# EAGLE schematic pcm2707_v1 (EAGLE 6.4)

## Sheet 1 of 3: Power - 3.3D
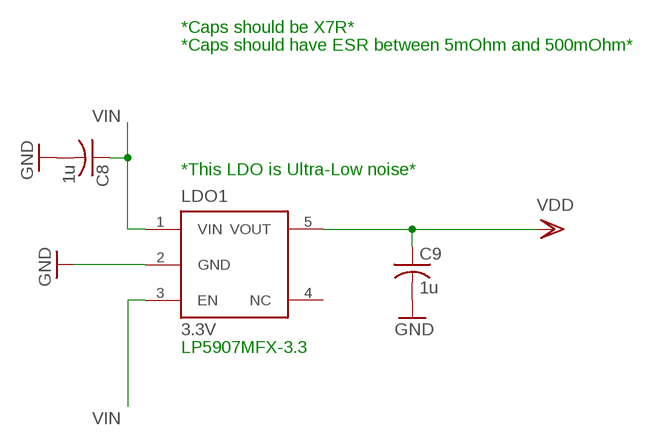
[diagram p0: schematic, sheet 1]

### Parts
C8  1u  C-USC0805  [C0805]
C9  1u  C-USC0805  [C0805]
LDO1  3.3V  LP5907MXF-3.3  [SOT-23]

### Nets
GND: C8.2 C9.2 LDO1.2(GND) ; also sheet 2,3
VDD: C9.1 LDO1.5(VOUT) ; also sheet 2
VIN: C8.1 LDO1.1(VIN) LDO1.3(EN)
Unconnected: LDO1.4(NC)

### Notes on the sheet
- *Caps should be X7R*
- *Caps should have ESR between 5mOhm and 500mOhm*
- *This LDO is Ultra-Low noise*
- LP5907MFX-3.3

## Sheet 2 of 3: DAC
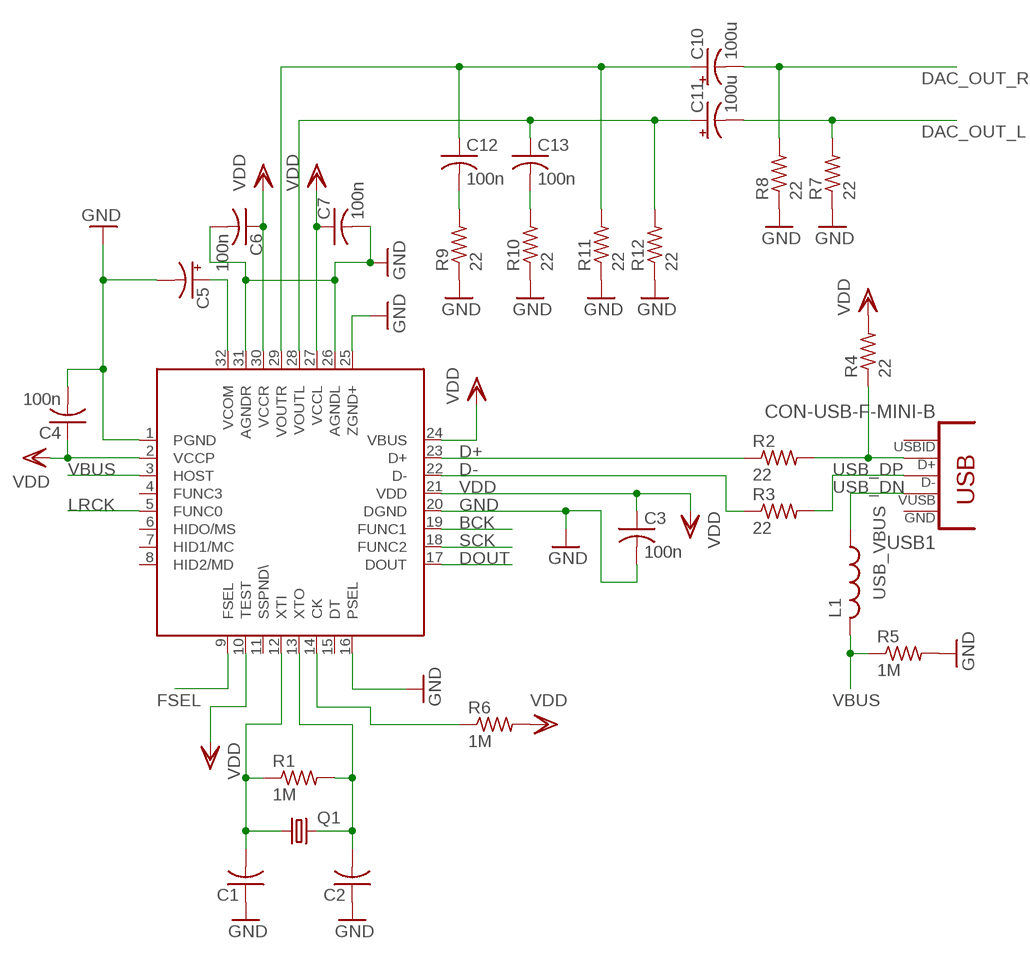
[diagram p1: schematic, sheet 2]

### Parts
C1  C-USC0402  [C0402]
C2  C-USC0402  [C0402]
C3  100n  C-USC0402  [C0402]
C4  100n  C-USC0402  [C0402]
C5  CPOL-USE1.8-4  [E1,8-4]
C6  100n  C-USC0402  [C0402]
C7  100n  C-USC0402  [C0402]
C10  100u  CPOL-USE1.8-4  [E1,8-4]
C11  100u  CPOL-USE1.8-4  [E1,8-4]
C12  100n  C-USC0402  [C0402]
C13  100n  C-USC0402  [C0402]
L1  L-USL3225M  [L3225M]
Q1  CRYSTALHC49US  [HC49US]
R1  1M  R-US_R0603  [R0603]
R2  22  R-US_R0402  [R0402]
R3  22  R-US_R0402  [R0402]
R4  22  R-US_R0402  [R0402]
R5  1M  R-US_R0402  [R0402]
R6  1M  R-US_R0402  [R0402]
R7  22  R-US_R0402  [R0402]
R8  22  R-US_R0402  [R0402]
R9  22  R-US_R0402  [R0402]
R10  22  R-US_R0402  [R0402]
R11  22  R-US_R0402  [R0402]
R12  22  R-US_R0402  [R0402]
U$1  PCM2707  [PCM2707]
USB1  CON-USB-F-MINI-B  [CONN_USB_MINI-B]

### Nets
BCK: U$1.19(FUNC1)
D+: R2.1 U$1.23(D+)
D-: R3.1 U$1.22(D-)
DAC_OUT_L: C11.- R7.2 ; also sheet 3
DAC_OUT_R: C10.- R8.2 ; also sheet 3
DOUT: U$1.17(DOUT)
FSEL: U$1.9(FSEL)
GND: C1.1 C2.1 C3.2 C4.2 C5.- C6.2 C7.2 R5.2 R7.1 R8.1 R9.1 R10.1 R11.1 R12.1 U$1.1(PGND) U$1.16(PSEL) U$1.20(DGND) U$1.25(ZGND+) U$1.26(AGNDL) U$1.31(AGNDR) ; also sheet 1,3
LRCK: U$1.5(FUNC0)
N$1: C5.+ U$1.32(VCOM)
N$2: C10.+ C12.1 R11.2 U$1.29(VOUTR)
N$3: C11.+ C13.1 R12.2 U$1.28(VOUTL)
N$6: C12.2 R9.2
N$7: C13.2 R10.2
N$10: R6.1 U$1.14(CK)
SCK: U$1.18(FUNC2)
USB_DN: R3.2 USB1.D-
USB_DP: R2.2 R4.1 USB1.D+
USB_VBUS: L1.1 USB1.VUSB
VBUS: L1.2 R5.1 U$1.3(HOST)
VDD: C3.1 C4.1 C6.1 C7.1 R4.2 R6.2 U$1.2(VCCP) U$1.10(TEST) U$1.21(VDD) U$1.24(VBUS) U$1.27(VCCL) U$1.30(VCCR) ; also sheet 1
XTI: C1.2 Q1.1 R1.1 U$1.12(XTI)
XTO: C2.2 Q1.2 R1.2 U$1.13(XTO)
Unconnected: U$1.4(FUNC3) U$1.6(HIDO/MS) U$1.7(HID1/MC) U$1.8(HID2/MD) U$1.11(SSPND\) U$1.15(DT) USB1.BODY@1(BODY) USB1.BODY@2(BODY) USB1.BODY@3(BODY) USB1.BODY@4(BODY) USB1.GND USB1.ID(USBID)

## Sheet 3 of 3
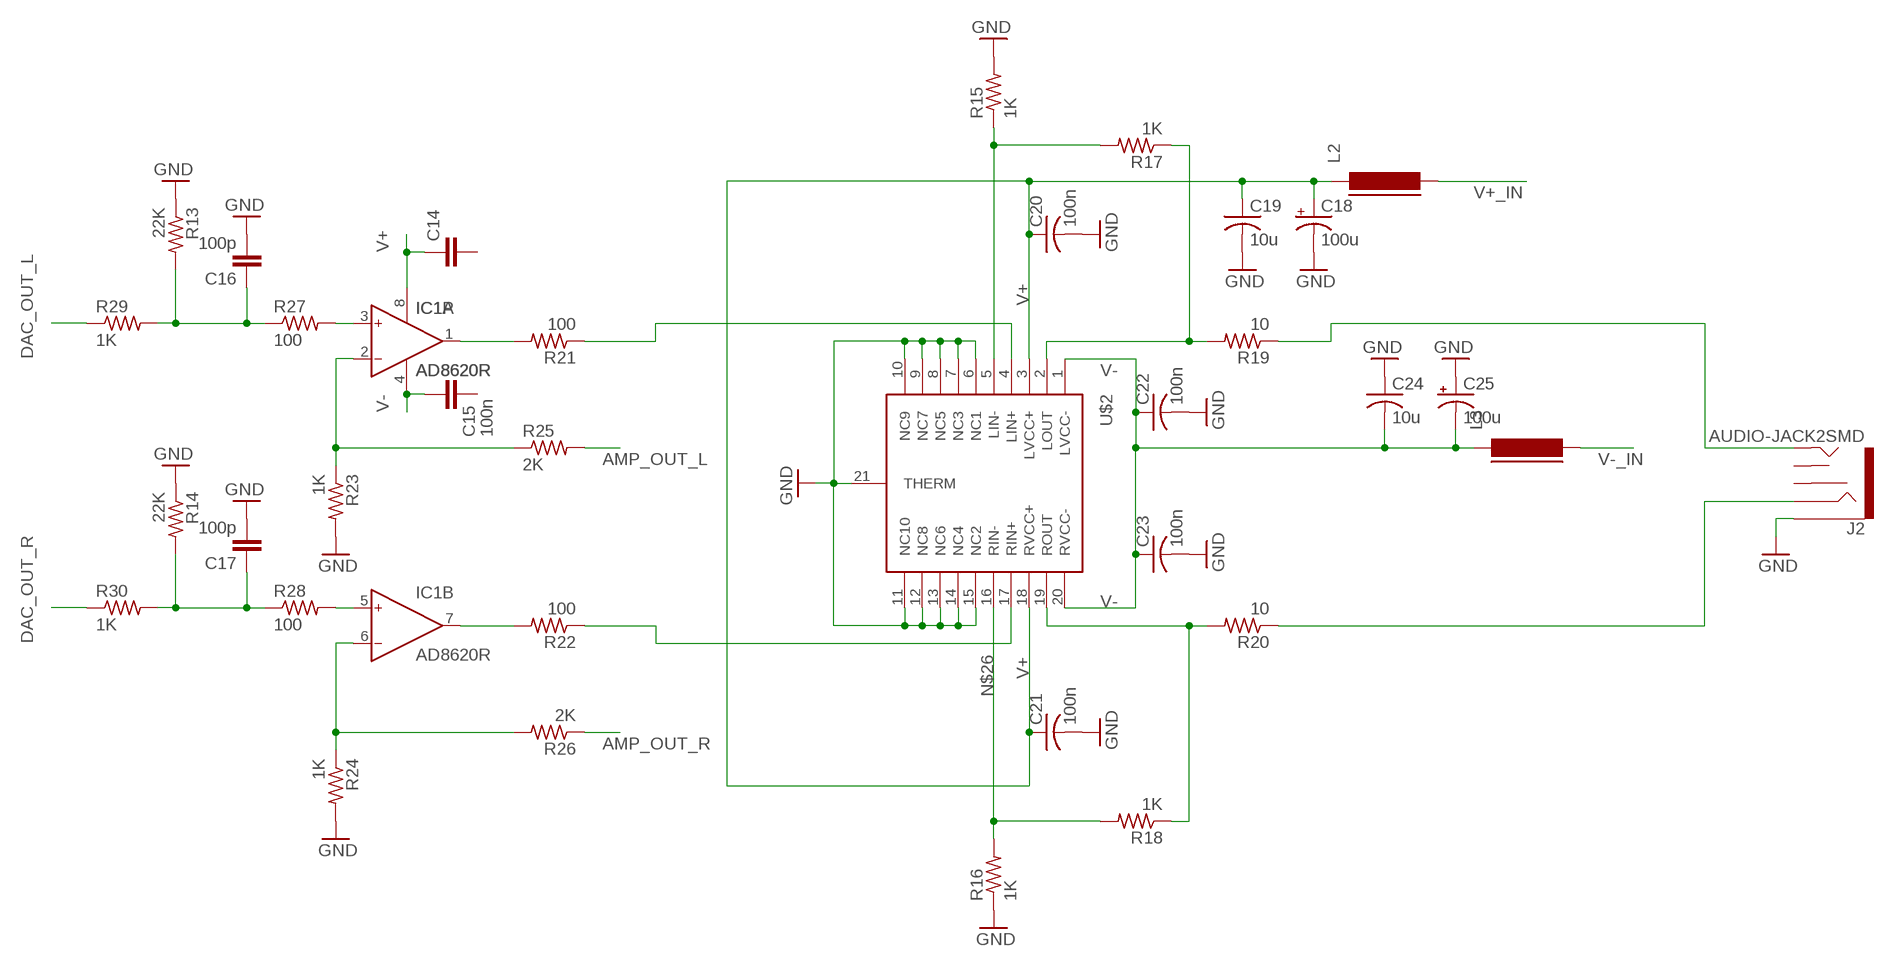
[diagram p2: schematic, sheet 3]

### Parts
C14  C-EUC0603  [C0603]
C15  100n  C-EUC0603  [C0603]
C16  100p  C-EUC0603  [C0603]
C17  100p  C-EUC0603  [C0603]
C18  100u  CPOL-USE5-10.5  [E5-10,5]
C19  10u  C-USC1210  [C1210]
C20  100n  C-USC0805  [C0805]
C21  100n  C-USC0805  [C0805]
C22  100n  C-USC0805  [C0805]
C23  100n  C-USC0805  [C0805]
C24  10u  C-USC1210  [C1210]
C25  100u  CPOL-USE5-10.5  [E5-10,5]
IC1  AD8620R  [SO8]
J2  AUDIO-JACK2SMD  [AUDIO-JACK-3.5MM-SMD]
L2  FERRITE-0805  [FB805]
L3  FERRITE-0805  [FB805]
R13  22K  R-US_R0603  [R0603]
R14  22K  R-US_R0603  [R0603]
R15  1K  R-US_R0805  [R0805]
R16  1K  R-US_R0805  [R0805]
R17  1K  R-US_R0805  [R0805]
R18  1K  R-US_R0805  [R0805]
R19  10  R-US_R1206  [R1206]
R20  10  R-US_R1206  [R1206]
R21  100  R-US_R0603  [R0603]
R22  100  R-US_R0603  [R0603]
R23  1K  R-US_R0603  [R0603]
R24  1K  R-US_R0603  [R0603]
R25  2K  R-US_R0603  [R0603]
R26  2K  R-US_R0603  [R0603]
R27  100  R-US_R0603  [R0603]
R28  100  R-US_R0603  [R0603]
R29  1K  R-US_R0603  [R0603]
R30  1K  R-US_R0603  [R0603]
U$2  TPA6120_TPA6120  [TPA6120_TPA6120]

### Nets
AMP_OUT_L: J2.TIP R19.1 R25.2
AMP_OUT_R: J2.RING R20.1 R26.1
DAC_OUT_L: R29.1 ; also sheet 2
DAC_OUT_R: R30.1 ; also sheet 2
GND: C16.2 C17.2 C18.- C19.2 C20.2 C21.2 C22.2 C23.2 C24.1 C25.+ J2.SLEEVE R13.1 R14.1 R15.2 R16.1 R23.2 R24.2 U$2.6(NC1) U$2.7(NC3) U$2.8(NC5) U$2.9(NC7) U$2.10(NC9) U$2.11(NC10) U$2.12(NC8) U$2.13(NC6) U$2.14(NC4) U$2.15(NC2) U$2.21(THERM) ; also sheet 1,2
N$4: IC1.5(B:IN+) R28.2
N$5: IC1.3(A:IN+) R27.2
N$11: IC1.1(A:OUT) R21.2
N$12: C16.1 R13.2 R27.1 R29.2
N$13: IC1.7(B:OUT) R22.2
N$14: C17.1 R14.2 R28.1 R30.2
N$17: IC1.2(A:IN-) R23.1 R25.1
N$18: IC1.6(B:IN-) R24.1 R26.2
N$21: R17.1 R19.2 U$2.2(LOUT)
N$22: R18.1 R20.2 U$2.19(ROUT)
N$25: R15.1 R17.2 U$2.5(LIN-)
N$26: R16.2 R18.2 U$2.16(RIN-)
N$27: R21.1 U$2.4(LIN+)
N$28: R22.1 U$2.17(RIN+)
V+: C14.1 C18.+ C19.1 C20.1 C21.1 IC1.8(P:V+) L2.1 U$2.3(LVCC+) U$2.18(RVCC+)
V+_IN: L2.2
V-: C15.1 C22.1 C23.1 C24.2 C25.- IC1.4(P:V-) L3.1 U$2.1(LVCC-) U$2.20(RVCC-)
V-_IN: L3.2
Unconnected: C14.2 C15.2 J2.RSH J2.TSH

## Library data of the parts
C1-C4 C6-C9 C12 C13 C19-C24 = rcl:C-US: CAPACITOR, American symbol
C5 C10 C11 C18 C25 = rcl:CPOL-US: POLARIZED CAPACITOR, American symbol
C14-C17 = rcl:C-EU: CAPACITOR, European symbol
IC1 = analog-devices:AD8620: Precision, Very Low Noise, Low Input Bias Current, Wide Bandwidth JFET Operational Amplifiers Source: http://www.analog.com/static/imported-files/data_sheets/AD8610_8620.pdf; MF: ALTERA CORPORATION; MPN: AD8620ARZ; OC_FARNELL: 9994386; OC_NEWARK: 59K6972
J2 = SparkFun-Connectors:AUDIO-JACK2: Stereo audio jack with bypass switches. Used on LilyPad MP3 board. Production SKU: CONN-10353; PROD_ID: CONN-10353
L1 = rcl:L-US: INDUCTOR, American symbol
L2 L3 = dp_devices:FERRITE: Ferrite bead in various packages
LDO1 = ti_ldo:LP5907MXF-3.3
Q1 = SparkFun:CRYSTAL: Crystals Various standard crystals. Proven footprints. Spark Fun Electronics SKU : COM-00534
R1-R30 = rcl:R-US_: RESISTOR, American symbol
U$1 = pcm2704c:PCM2707: Upgraded version of the PCM2704. It allows connecting to a device with USB and transmitting that data to another DAC using I2S protocol. Also has other advanced features that allow control with SPI, external buttons, etc.
U$2 = amp:TPA6120_TPA6120
USB1 = dp_devices:CON-USB-F: USB Female connector